# Altium schematic sheet STM32F103.SchDoc
size A4
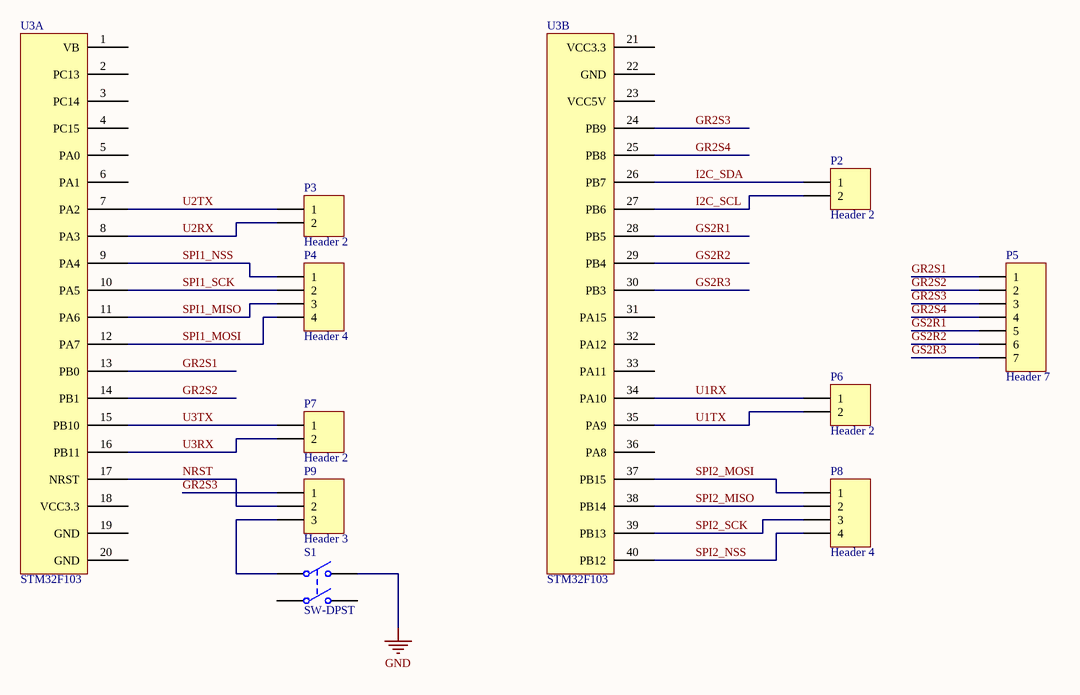
[diagram p0: STM32F103.SchDoc]

## Parts
P2  Header 2  [HDR1X2]
P3  Header 2  [HDR1X2]
P4  Header 4  [HDR1X4]
P5  Header 7  [HDR1X7]
P6  Header 2  [HDR1X2]
P7  Header 2  [HDR1X2]
P8  Header 4  [HDR1X4]
P9  Header 3  [HDR1X3]
S1  SW-DPST  [SW6x6]
U3  STM32F103  [STM32F103C8T6]  (parts A,B of 2)

## Nets
GND: S1.2(NO1)
GR2S1: P5.1 U3.13(PB0)
GR2S2: P5.2 U3.14(PB1)
GR2S3: P5.3 P9.1 U3.24(PB9)
GR2S4: P5.4 U3.25(PB8)
GS2R1: P5.5 U3.28(PB5)
GS2R2: P5.6 U3.29(PB4)
GS2R3: P5.7 U3.30(PB3)
I2C_SCL: P2.2 U3.27(PB6)
I2C_SDA: P2.1 U3.26(PB7)
NRST: P9.2 U3.17(NRST)
SPI1_MISO: P4.3 U3.11(PA6)
SPI1_MOSI: P4.4 U3.12(PA7)
SPI1_NSS: P4.1 U3.9(PA4)
SPI1_SCK: P4.2 U3.10(PA5)
SPI2_MISO: P8.2 U3.38(PB14)
SPI2_MOSI: P8.1 U3.37(PB15)
SPI2_NSS: P8.4 U3.40(PB12)
SPI2_SCK: P8.3 U3.39(PB13)
U1RX: P6.1 U3.34(PA10)
U1TX: P6.2 U3.35(PA9)
U2RX: P3.2 U3.8(PA3)
U2TX: P3.1 U3.7(PA2)
U3RX: P7.2 U3.16(PB11)
U3TX: P7.1 U3.15(PB10)
NetP9_3: P9.3 S1.1(COMMON1)

Not connected (* = marked no-connect by the designer): S1 3(COMMON2) 4(NO2); U3 1(VB) 2(PC13) 3(PC14) 4(PC15) 5(PA0) 6(PA1) 18(VCC3.3) 19(GND) 20(GND) 21(VCC3.3) 22(GND) 23(VCC5V) 31(PA15) 32(PA12) 33(PA11) 36(PA8)

## Library data of the parts
P2 P3 P6 P7 = Header 2: Header, 2-Pin; LatestRevisionDate: 17-Jul-2002; LatestRevisionNote: Re-released for DXP Platform.; Publisher: Altium Limited
P4 P8 = Header 4: Header, 4-Pin; LatestRevisionDate: 17-Jul-2002; LatestRevisionNote: Re-released for DXP Platform.; Publisher: Altium Limited
P5 = Header 7: Header, 7-Pin; LatestRevisionDate: 17-Jul-2002; LatestRevisionNote: Re-released for DXP Platform.; Publisher: Altium Limited
P9 = Header 3: Header, 3-Pin; LatestRevisionDate: 17-Jul-2002; LatestRevisionNote: Re-released for DXP Platform.; Publisher: Altium Limited
S1 = SW-DPST: Double-Pole, Single-Throw Switch; Published: 24-Mar-1999; LatestRevisionDate: 17-Jul-2002; LatestRevisionNote: Re-released for DXP Platform.; PackageReference: DPST-4; Publisher: Altium Limited
U3 = STM32F103C8T6